# EAGLE design ModuleThermistorVoltageSenseBoard-1 (EAGLE 9.6.2)
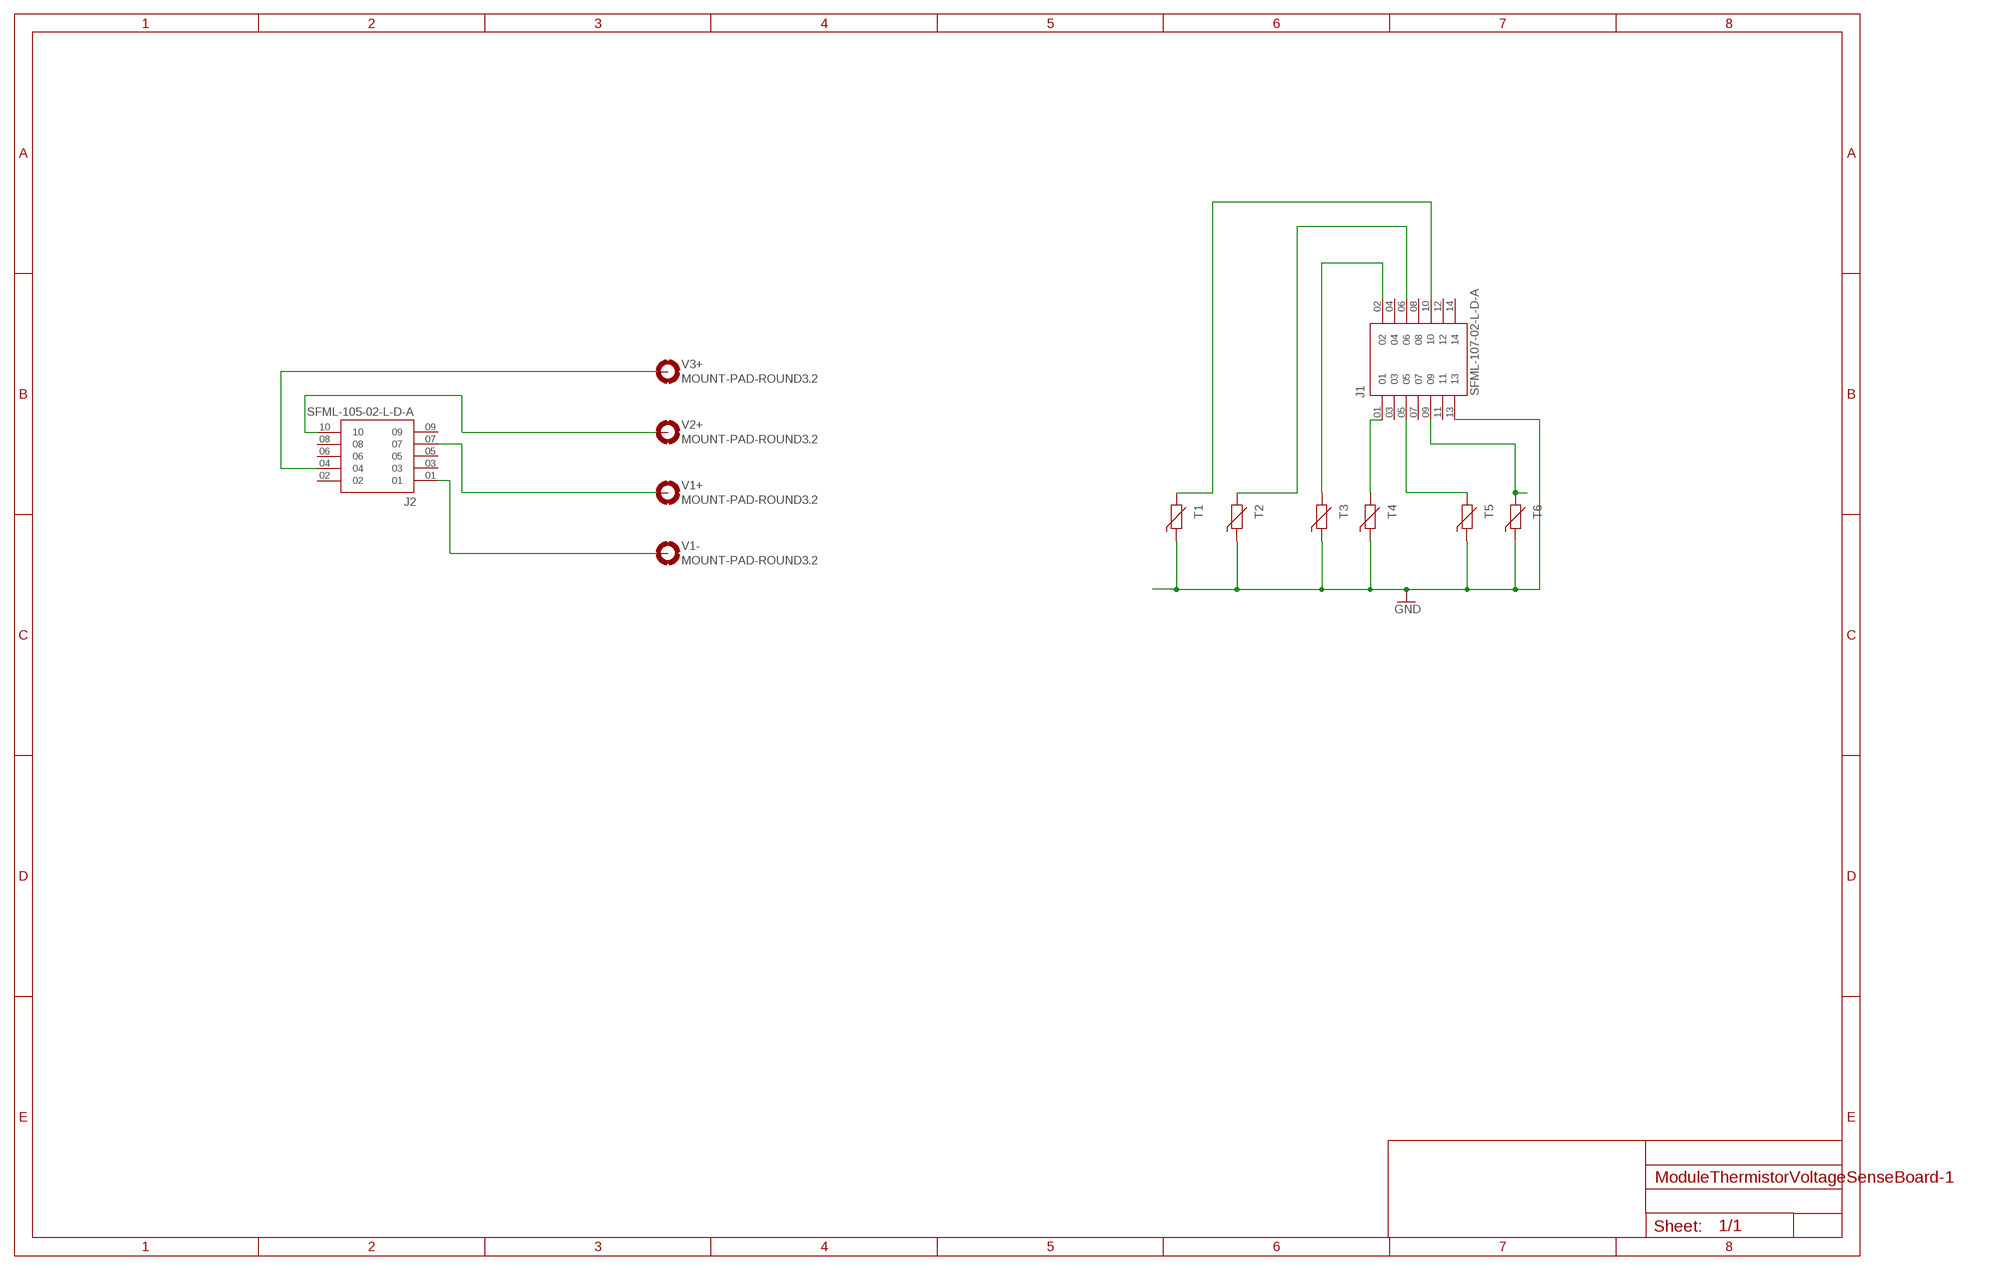
[diagram p0: schematic, sheet 1]

## Parts
J1  SFML-107-02-L-D-A  [SAMTEC_SFML-107-02-L-D-A]
J2  SFML-105-02-L-D-A  [SAMTEC_SFML-105-02-L-D-A]
T1  THERMISTOR  [THERMISTOR_CUTOUT]
T2  THERMISTOR  [THERMISTOR_CUTOUT]
T3  THERMISTOR  [THERMISTOR_CUTOUT]
T4  THERMISTOR  [THERMISTOR_CUTOUT]
T5  THERMISTOR  [THERMISTOR_CUTOUT]
T6  THERMISTOR  [THERMISTOR_CUTOUT]
V1+  MOUNT-PAD-ROUND3.2  [3,2-PAD]
V1-  MOUNT-PAD-ROUND3.2  [3,2-PAD]
V2+  MOUNT-PAD-ROUND3.2  [3,2-PAD]
V3+  MOUNT-PAD-ROUND3.2  [3,2-PAD]

## Nets
GND: J1.13 T1.1 T2.1 T3.1 T4.1 T5.1 T6.1
N$1: J1.05 T5.2
N$2: J1.09 T6.2
N$3: J1.01 T4.2
N$4: J1.02 T3.2
N$5: J1.06 T2.2
N$6: J1.10 T1.2
V1+: J2.07 V1+.B3,2(MOUNT)
V1-: J2.01 V1-.B3,2(MOUNT)
V2+: J2.10 V2+.B3,2(MOUNT)
V3+: J2.04 V3+.B3,2(MOUNT)
Unconnected: J1.03 J1.04 J1.07 J1.08 J1.11 J1.12 J1.14 J2.02 J2.03 J2.05 J2.06 J2.08 J2.09

## Library data of the parts
J1 = SFML-107-02-L-D-A:SFML-107-02-L-D-A: Check availability <https://pricing.snapeda.com/parts/SFML-107-02-L-D-A/Samtec/view-part?ref=eda>; AVAILABILITY: In Stock; DESCRIPTION: 14 Position Receptacle Connector 0.050 (1.27mm) Surface Mount Gold; MF: Samtec; MP: SFML-107-02-L-D-A; PACKAGE: None; PRICE: None; PURCHASE-URL: https://pricing.snapeda.com/search/part/SFML-107-02-L-D-A/?ref=eda
J2 = SFML-105-02-L-D-A:SFML-105-02-L-D-A: Check availability <https://pricing.snapeda.com/parts/SFML-105-02-L-D-A/Samtec/view-part?ref=eda>; AVAILABILITY: In Stock; DESCRIPTION: SFML - Samtec 1.27mm Tiger Eye High-Reliability Surface Mount Locking Socket; MF: Samtec; MP: SFML-105-02-L-D-A; PACKAGE: None; PRICE: None; PURCHASE-URL: https://pricing.snapeda.com/search/part/SFML-105-02-L-D-A/?ref=eda
T1-T6 = Thermistor:THERMISTOR
V1+ V1- V2+ V3+ = holes:MOUNT-PAD-ROUND: MOUNTING PAD, round

## Board
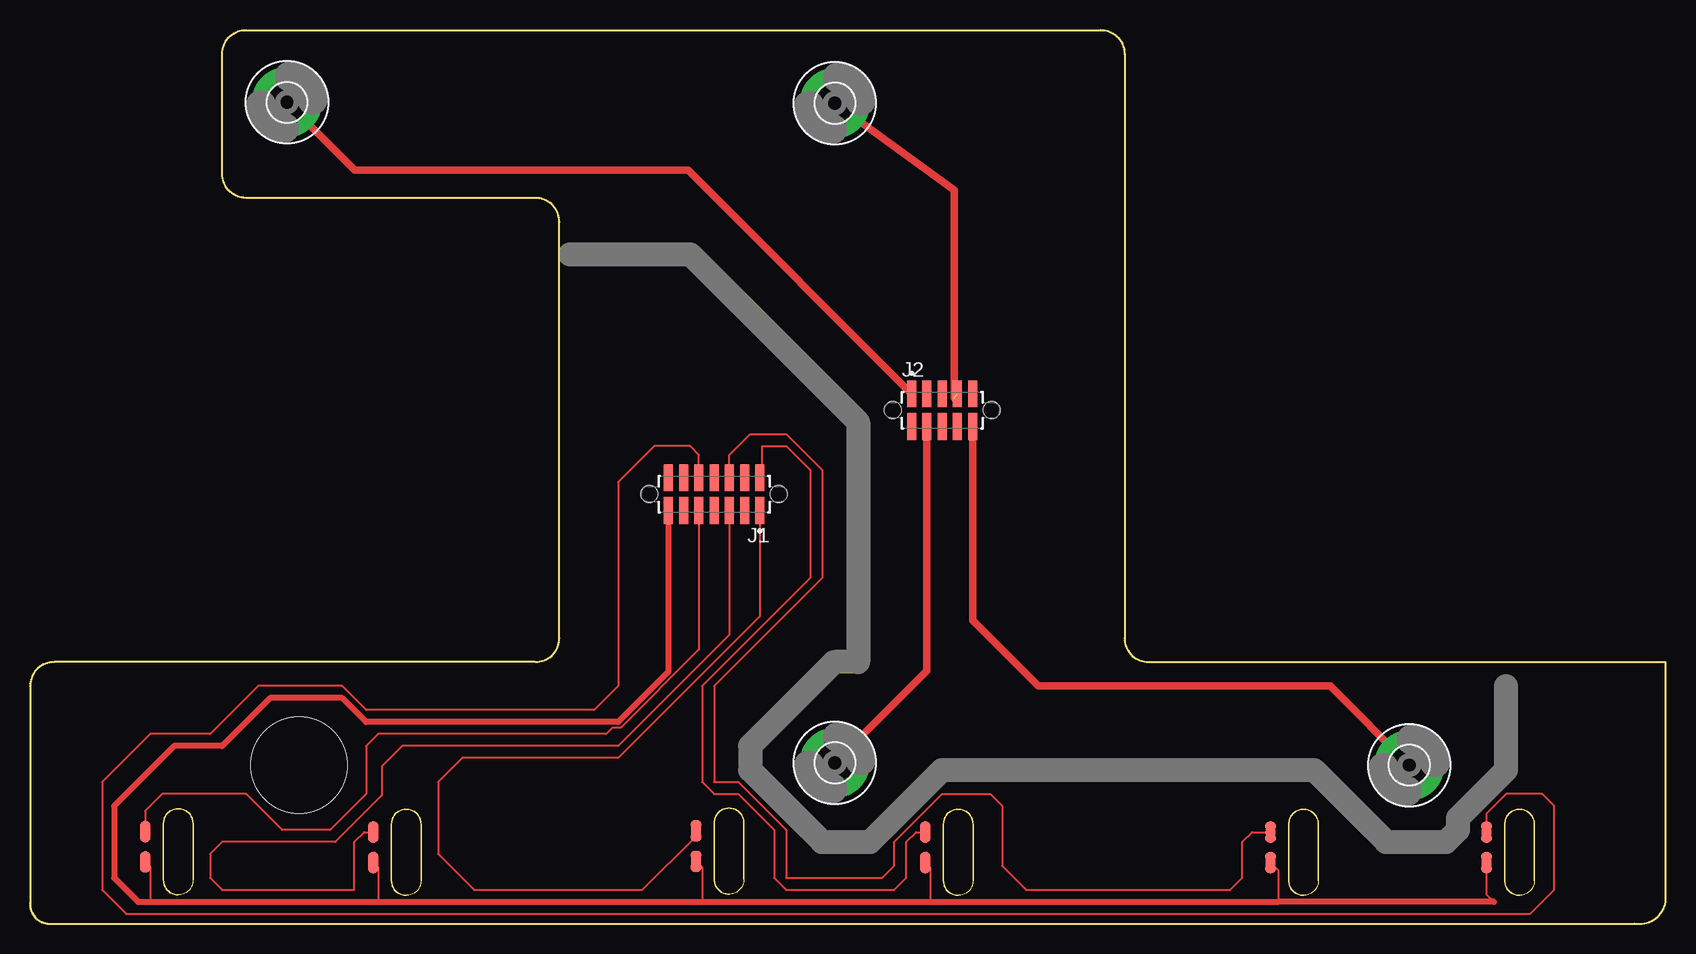
[diagram p1: board, top side]

Size 136.31 x 74.54 mm. Coordinates in mm from the lower left corner, seen from the top.
Outline: 42.11,21.84 2.01,21.84 arc90 0.01,19.84 0.01,1.84 arc90 1.41,0.04 133.71,0.04 arc90 136.31,1.84 136.31,21.84 93.21,21.84 arc-90 91.21,23.84 91.21,72.54 arc90 89.21,74.54 18.01,74.54 arc90 16.01,72.54 16.01,62.54 arc90 18.01,60.54 42.11,60.54 arc-90 44.11,58.54 44.11,23.84 arc-90 42.11,21.84
Copper layers (1*16): Top 0.035mm / dielectric 1.5mm / Bottom 0.035mm
Design rules "default *": minimum track width 6mil, minimum drill 0.35mm, track to track 6mil, track to pad 6mil, pad to pad 6mil, via to via 6mil, smd to smd 6mil, copper to edge 10mil, drill to drill 0.4mm, minimum pad ring 10mil, minimum via ring 8mil, stop-mask expansion 4mil, vias tented up to drill 0mil, thermal gap 10mil
Holes 8 mm at 22.41,13.25

### Footprints (pad centres in the part's own frame; a part is rotated, then mirrored left to right if it is on the bottom)
SAMTEC_SFML-107-02-L-D-A = smd 0.74 x 2.22: 01 -3.81,1.365; 02 -3.81,-1.365; 03 -2.54,1.365; 04 -2.54,-1.365; 05 -1.27,1.365; 06 -1.27,-1.365; 07 0,1.365; 08 0,-1.365; 09 1.27,1.365; 10 1.27,-1.365; 11 2.54,1.365; 12 2.54,-1.365; 13 3.81,1.365; 14 3.81,-1.365 | hole 1.4: -5.4,0; 5.4,0
SAMTEC_SFML-105-02-L-D-A = smd 0.74 x 2.22: 01 -2.54,1.365; 02 -2.54,-1.365; 03 -1.27,1.365; 04 -1.27,-1.365; 05 0,1.365; 06 0,-1.365; 07 1.27,1.365; 08 1.27,-1.365; 09 2.54,1.365; 10 2.54,-1.365 | hole 1.4: -4.13,0; 4.13,0
THERMISTOR_CUTOUT = smd 1.778 x 0.914: 1 5.715,-1.524; 2 3.175,-1.524
3,2-PAD = drill 3.2 pad 5.842: B3,2 0,0

### Placement (x,y rotation side)
J1  57.01,35.84 180 top
J2  76.01,42.84 0 top
T1  122.9,10.84 270 top
T2  104.9,10.84 270 top
T3  76.12,10.84 270 top
T4  57.02,10.94 270 top
T5  30.12,10.84 270 top
T6  11.12,10.89 270 top
V1+  67.07,68.44 180 top
V1-  21.41,68.51 0 top
V2+  114.94,13.24 0 top
V3+  67.07,13.44 0 top

### Tracks (layer width: path | path; a pad name or v marks a point on that pad's centre or on a via)
GND
  Top 0.152: 9.6,4.84 T6.1 10.01,4.76 10.01,1.84 | 55.12,4.84 T4.1 56.01,4.71 56.01,1.84 | T5.1 29.01,4.71 29.01,1.84 | T3.1 75.01,4.71 75.01,1.84 | T2.1 104.01,4.48 104.01,1.84 | T1.1 121.37,2.47 122.01,1.84
  Top 0.508: J1.13 53.2,21.03 49.01,16.84 28.01,16.84 26.01,18.84 20.01,18.84 16.01,14.84 12.01,14.84 7.01,9.84 7.01,3.84 9.01,1.84 10.01,1.84 29.01,1.84 56.01,1.84 75.01,1.84 104.01,1.84 122.01,1.84
N$1
  Top 0.152: J1.05 58.28,24.11 49.01,14.84 31.01,14.84 29.32,13.14 29.32,10.71 25.44,6.84 16.01,6.84 15.01,5.84 15.01,3.84 16.01,2.84 27.01,2.84 27.01,6.84 27.84,7.66 T5.2
N$2
  Top 0.152: J1.09 55.74,22.88 49.21,16.35 48.53,16.35 48.01,15.84 29.01,15.84 28.01,14.84 28.01,10.84 25.01,7.84 21.01,7.84 18.01,10.84 11.01,10.84 9.6,9.43 T6.2
N$3
  Top 0.152: J1.01 60.82,25.65 49.01,13.84 36.01,13.84 34.01,11.84 34.01,5.84 37.01,2.84 51.01,2.84 55.5,7.33 T4.2
N$4
  Top 0.152: J1.02 61.01,37.39 61.01,39.84 63.01,39.84 65.01,37.84 65.01,28.84 56.01,19.84 56.01,11.84 57.01,10.84 59.01,10.84 62.01,7.84 62.01,3.84 63.01,2.84 72.01,2.84 73.01,3.84 73.01,6.84 73.84,7.66 T3.2
N$5
  Top 0.152: 58.01,37.47 J1.06 58.28,39.11 60.01,40.84 63.01,40.84 66.01,37.84 66.01,28.84 57.01,19.84 57.01,11.84 59.01,11.84 63.01,7.84 63.01,3.84 71.01,3.84 72.01,4.84 72.01,6.84 76.01,10.84 80.01,10.84 81.01,9.84 81.01,4.84 83.01,2.84 100.01,2.84 101.01,3.84 101.01,6.84 101.84,7.66 T2.2
N$6
  Top 0.152: T1.2 121.37,7.84 121.37,8.5 121.37,9.2 123.01,10.84 126.01,10.84 127.01,9.84 127.01,2.84 125.01,0.84 8.01,0.84 6.01,2.84 6.01,11.84 10.01,15.84 15.01,15.84 19.01,19.84 26.01,19.84 28.01,17.84 47.01,17.84 49.01,19.84 49.01,36.84 52.01,39.84 55.01,39.84 55.74,39.11 J1.10
V1+  (1 unrouted)
  Top 0.61: V1+.B3,2 77.01,61.2 77.01,43.84
V1-
  Top 0.61: J2.01 54.84,62.84 27.08,62.84 V1-.B3,2
V2+
  Top 0.61: V2+.B3,2 108.34,19.84 84.01,19.84 78.55,25.3 J2.10
V3+
  Top 0.61: V3+.B3,2 74.74,21.11 J2.04

### Text on the board
tDocu: lv | TS